# Altium project mb1225.PrjPCB (part 1 of 2)
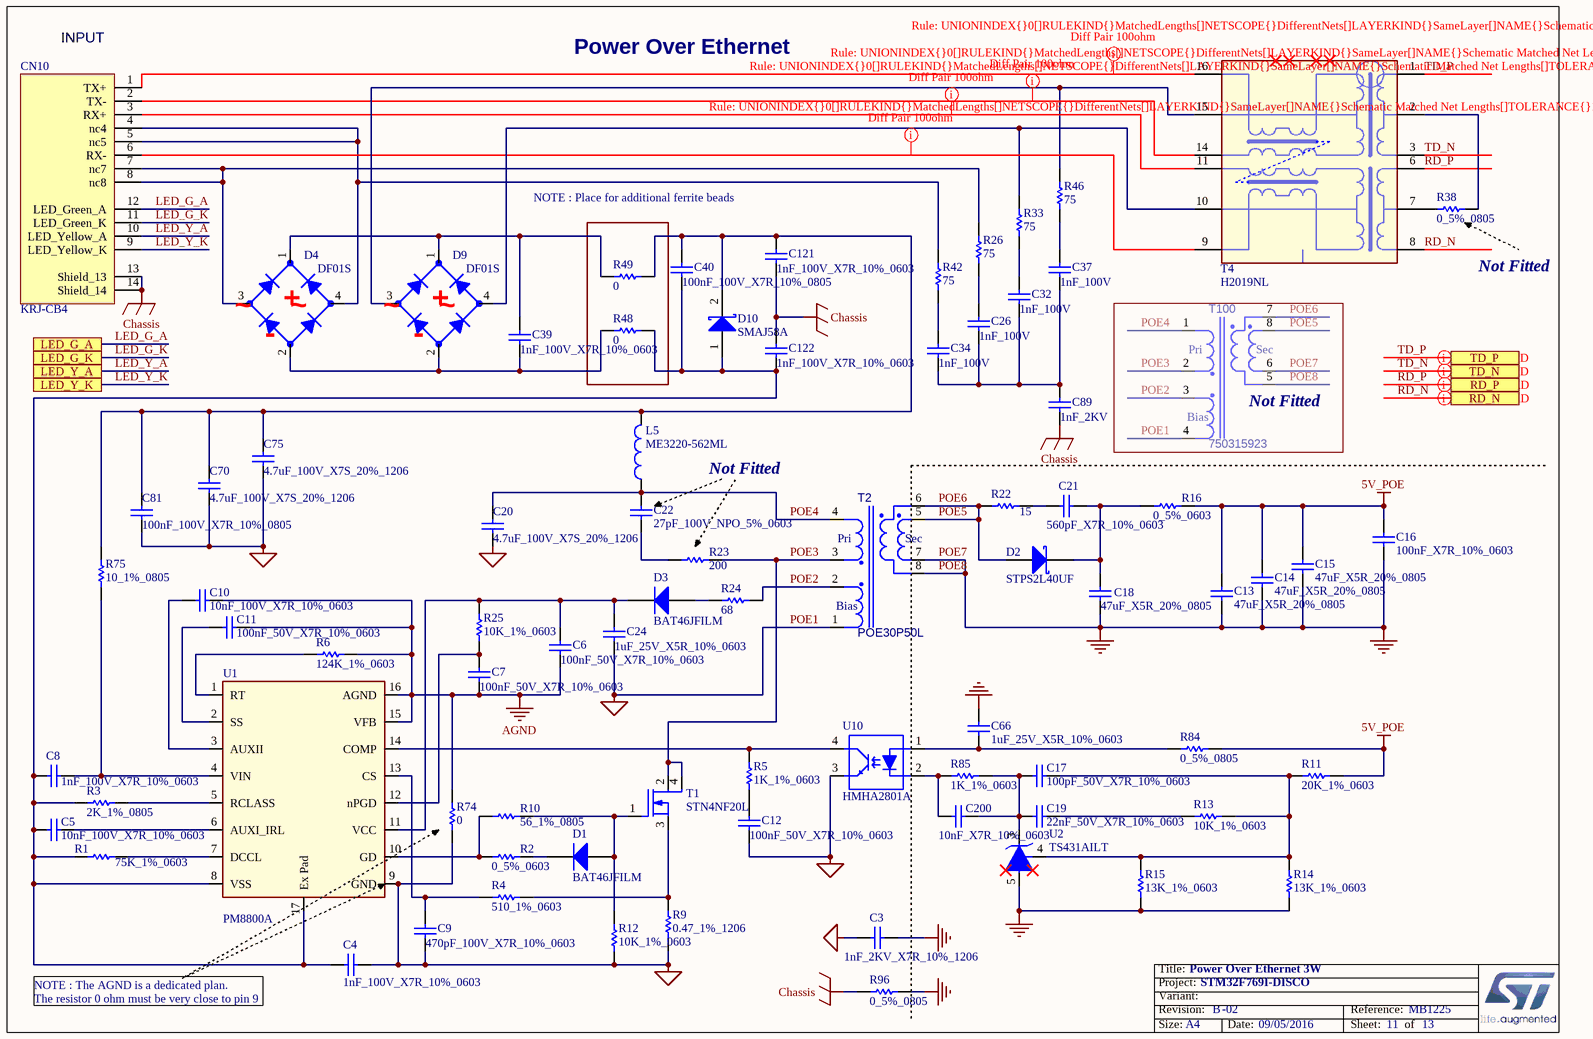
[diagram p0: PoE.SchDoc]
Board_Assembly_Revision: 02; Board_document_Date: 09/05/2016; Board_Name: STM32F769I-DISCO; Board_PCB_Revision: B; Board_Reference: MB1225
7 sheets, 271 parts. Net scope: hierarchical (ports join the sheet entries above them; power ports are global).
Board file: MB1225.PcbDoc
Sheets:
  PoE.SchDoc
  TOP.SchDoc
    U_AUDIO = AUDIO.SchDoc
    U_QSPI = QSPI.SchDoc
    U_SDRAM = SDRAM.SchDoc
    U_STM32F7 = STM32F7.SchDoc
    U_DSI_LCD = DSI_LCD.SchDoc

## Sheet PoE.SchDoc: Power Over Ethernet 3W
size A4; Date: 29-OCT-2015; Author: A.B; CompanyName: STMicroelectronics; Organization: MCD/TOOLS/GNB; Address1: 12, Rue Jules HOROWITZ; Address2: 38019 Grenoble; Address3: FRANCE; DocumentNumber: MB1225; Revision: B-01; SheetNumber: 11; SheetTotal: 13; Project: STM32F769I-DISCO

### Parts
C3  1nF_2KV_X7R_10%_1206  [1206C]
C4  1nF_100V_X7R_10%_0603  [0603C]
C5  10nF_100V_X7R_10%_0603  [0603C]
C6  100nF_50V_X7R_10%_0603  [0603C]
C7  100nF_50V_X7R_10%_0603  [0603C]
C8  1nF_100V_X7R_10%_0603  [0603C]
C9  470pF_100V_X7R_10%_0603  [0603C]
C10  10nF_100V_X7R_10%_0603  [0603C]
C11  100nF_50V_X7R_10%_0603  [0603C]
C12  100nF_50V_X7R_10%_0603  [0603C]
C13  47uF_X5R_20%_0805  [0805C]
C14  47uF_X5R_20%_0805  [0805C]
C15  47uF_X5R_20%_0805  [0805C]
C16  100nF_X7R_10%_0603  [0603C]
C17  100pF_50V_X7R_10%_0603  [0603C]
C18  47uF_X5R_20%_0805  [0805C]
C19  22nF_50V_X7R_10%_0603  [0603C]
C20  4.7uF_100V_X7S_20%_1206  [1206C]
C21  560pF_X7R_10%_0603  [0603C]
C22  27pF_100V_NPO_5%_0603  [0603C]
C24  1uF_25V_X5R_10%_0603  [0603C]
C26  1nF_100V  [0603C]
C32  1nF_100V  [0603C]
C34  1nF_100V  [0603C]
C37  1nF_100V  [0603C]
C39  1nF_100V_X7R_10%_0603  [0603C]
C40  100nF_100V_X7R_10%_0805  [0805C]
C66  1uF_25V_X5R_10%_0603  [0603C]
C70  4.7uF_100V_X7S_20%_1206  [1206C]
C75  4.7uF_100V_X7S_20%_1206  [1206C]
C81  100nF_100V_X7R_10%_0805  [0805C]
C89  1nF_2KV  [1206C]
C121  1nF_100V_X7R_10%_0603  [0603C]
C122  1nF_100V_X7R_10%_0603  [0603C]
C200  10nF_X7R_10%_0603  [0603C]
CN10  KRJ-CB4  [RJ45_LED_KRJ-CB4R2GYZNL_EM]
D1  BAT46JFILM  [SOD-323]
D2  STPS2L40UF  [SMB]
D3  BAT46JFILM  [SOD-323]
D4  DF01S  [DBS101-107G]
D9  DF01S  [DBS101-107G]
D10  SMAJ58A  [SMA]
L5  ME3220-562ML  [LSM2_3R2X2R8_H2]
R1  75K_1%_0603  [0603R]
R2  0_5%_0603  [0603R-GS]
R3  2K_1%_0805  [0805R]
R4  510_1%_0603  [0603R]
R5  1K_1%_0603  [0603R]
R6  124K_1%_0603  [0603R]
R9  0.47_1%_1206  [1206R]
R10  56_1%_0805  [0805R]
R11  20K_1%_0603  [0603R]
R12  10K_1%_0603  [0603R]
R13  10K_1%_0603  [0603R]
R14  13K_1%_0603  [0603R]
R15  13K_1%_0603  [0603R]
R16  0_5%_0603  [0603R-GS]
R22  15  [0805R]
R23  200  [1206R]
R24  68  [0805R]
R25  10K_1%_0603  [0603R]
R26  75  [0805R]
R33  75  [0805R]
R38  0_5%_0805  [0805R]
R42  75  [0805R]
R46  75  [0805R]
R48  0  [0805R]
R49  0  [0805R]
R74  0  [0603R-GS]
R75  10_1%_0805  [0805R]
R84  0_5%_0805  [0805R]
R85  1K_1%_0603  [0603R]
R96  0_5%_0805  [0805R]
T1  STN4NF20L  [SOT-223]
T2  POE30P50L  [TF_10R9X13R2-12R2X14R4_CPT]
T4  H2019NL  [TF_16SM_12R7X9R65]
T100  750315923  [TF_8SM_12R04X12R85]
U1  PM8800A  [TSSOP16_0R65_5x6R4_TP]
U2  TS431AILT  [SOT23-5]
U10  HMHA2801A  [PC_4SM_1R27_2R5X6R8]

### Blocks framed on the sheet
Not Fitted: T100

### Ports
LED_G_A, LED_G_K, LED_Y_A, LED_Y_K, RD_N, RD_P, TD_N, TD_P

### Nets
5V_POE: C13.2 C14.2 C15.2 C16.2 R11.2 R16.2 R84.2
AGND: C6.1 C7.1 C10.2 C11.2 R6.2 R74.2 U1.15(VFB) U1.16(AGND)
Chassis: C89.1 C121.1 C122.2 CN10.13(Shield_13) CN10.14(Shield_14) R96.1
POE1: C3.1 C4.2 C9.1 C12.1 C20.1 C24.1 C70.1 C75.1 C81.1 R9.1 R12.1 R74.1 T2.1 T100.4 U1.9(GND) U10.3(Emitter)  [also labelled GND_POWER_IN]
POE7: C3.2 C13.1 C14.1 C15.1 C16.1 C18.1 C66.2 R14.1 R15.1 R96.2 T2.7 T2.8 T100.5 T100.6 U2.5(A)  [also labelled GND, POE8]
LED_G_A: CN10.12(LED_Green_A) ; port LED_G_A
LED_G_K: CN10.11(LED_Green_K) ; port LED_G_K
LED_Y_A: CN10.10(LED_Yellow_A) ; port LED_Y_A
LED_Y_K: CN10.9(LED_Yellow_K) ; port LED_Y_K
POE2: R24.2 T2.2 T100.3
POE3: R23.2 T1.2(D) T1.4(D) T2.3 T100.2
POE4: C20.2 C22.2 L5.1 T2.4 T100.1
POE5: D2.1(A) R22.1 T2.5 T2.6 T100.7 T100.8  [also labelled POE6]
RD_N: T4.8(rd-) ; port RD_N
RD_P: T4.6(rd+) ; port RD_P
TD_N: T4.3(td-) ; port TD_N
TD_P: T4.1(td+) ; port TD_P
NetC4_1: C4.1 C5.1 C8.1 C40.1 C122.1 D10.1(A) R1.1 R3.1 R48.2 U1.8(VSS) U1.17(Ex_Pad)
NetC5_2: C5.2 U1.6(AUXI_IRL)
NetC6_2: C6.2 C24.2 D3.2(K) R25.2 U1.11(VCC)
NetC7_2: C7.2 R25.1 U1.12(nPGD)
NetC8_2: C8.2 R75.1 U1.4(VIN)
NetC9_2: C9.2 R4.1 U1.13(CS)
NetC10_1: C10.1 U1.3(AUXII)
NetC11_1: C11.1 U1.2(SS)
NetC12_2: C12.2 R5.1
NetC17_1: C17.1 C19.1 C200.2 R85.2 U2.3(K)
NetC17_2: C17.2 R11.1 R13.2 R14.2 R15.2 U2.4(REF)
NetC18_2: C18.2 C21.2 D2.2(K) R16.1
NetC19_2: C19.2 R13.1
NetC21_1: C21.1 R22.2
NetC22_1: C22.1 R23.1
NetC26_1: C26.1 C32.1 C34.1 C37.1 C89.2
NetC26_2: C26.2 R26.1
NetC32_2: C32.2 R33.1
NetC34_2: C34.2 R42.1
NetC37_2: C37.2 R46.1
NetC39_1: C39.1 D4.2(DC_OUT_MINUS) D9.2(DC_OUT_MINUS) R48.1
NetC39_2: C39.2 D4.1(DC_OUT_PLUS) D9.1(DC_OUT_PLUS) R49.1
NetC40_2: C40.2 C70.2 C75.2 C81.2 C121.2 D10.2(K) L5.2 R49.2 R75.2
NetC66_1: C66.1 R84.1 U10.1(Anode)
NetC200_1: C200.1 R85.1 U10.2(B)
NetCN10_1: CN10.1(TX+) T4.16(tx1+)
NetCN10_2: CN10.2(TX-) T4.14(tx1-)
NetCN10_3: CN10.3(RX+) T4.11(rx1+)
NetCN10_4: CN10.4(nc4) CN10.5(nc5) D4.4(AC_IN_1) R42.2
NetCN10_6: CN10.6(RX-) T4.9(rx-)
NetCN10_7: CN10.7(nc7) CN10.8(nc8) D4.3(AC_IN_2) R26.2
NetD1_1: D1.1(A) R10.2 R12.2 T1.1(G)
NetD1_2: D1.2(K) R2.2
NetD3_1: D3.1(A) R24.1
NetD9_3: D9.3(AC_IN_2) R46.2 T4.15(txct)
NetD9_4: D9.4(AC_IN_1) R33.2 T4.10(rxct)
NetR1_2: R1.2 U1.7(DCCL)
NetR2_1: R2.1 R10.1 U1.10(GD)
NetR3_2: R3.2 U1.5(RCLASS)
NetR4_2: R4.2 R9.2 T1.3(S)
NetR5_2: R5.2 U1.14(COMP) U10.4(Collector)
NetR6_1: R6.1 U1.1(RT)
NetR38_1: R38.1 T4.7(rct)
NetR38_2: R38.2 T4.2(tct)

Not connected (* = marked no-connect by the designer): T4 4(nc_4)* 5(nc_5)* 12(nc_12)* 13(nc_13)*; U2 1(nc_1)* 2(nc_2)*

### Layout directives
differential pair: RD_N, RD_P, TD_N, TD_P
rule Matched Net Lengths [Tolerance = 100mil]: NetCN10_1, NetCN10_2, NetCN10_3, NetCN10_6

### Notes on the sheet
- (near CN10) INPUT
- Power Over Ethernet
- NOTE : Place for additional ferrite beads
- (near R38) Not Fitted
- Not Fitted
- NOTE : The AGND is a dedicated plan.
  The resistor 0 ohm must be very close to pin 9
- Title:
- Project:
- Size:
- Revision:
- Variant:
- A4
- -
- Date:
- Reference:
- Sheet:
- of
- (in symbol DF01S_SMD) ~; +; -
- (in symbol POE30P_C) Pri; Sec; Bias
- (in symbol POE30P_W) Pri; Sec; Bias

### Library data of the parts
C3 C89 = Cap_1nF_2KV_X7R_10%_1206: Capacitor,1nF,2KV,X7R,10%,1206,YAGEO; Order: CC1206KKX7RDBB102; Revision: July-2002: Re-released for DXP Platform.; Value: 1nF; Manuf_1: YAGEO; Manuf_Part_1: CC1206KKX7RDBB102; ECCN_US/EU: n/a
C4 C8 C26 C32 C34 C37 C39 C121 C122 = Cap_1nF_100V_X7R_10%_0603: Capacitor,1nF,100V,X7R,10%,0603,YAGEO; Order: CC0603KRX7R0BB102; Revision: July-2002: Re-released for DXP Platform.; Value: 1nF; Manuf_1: YAGEO; Manuf_Part_1: CC0603KRX7R0BB102; ECCN_US/EU: n/a
C5 C10 = Cap_10nF_100V_X7R_10%_0603: Capacitor,10nF,100V,X7R,10%,0603,YAGEO; Manuf_Part_1: CC0603KRX7R0BB103; Revision: July-2002: Re-released for DXP Platform.; Value: 10nF; Order: CC0603KRX7R0BB103; Manuf_1: YAGEO; ECCN_US/EU: n/a
C6 C7 C11 C12 = Cap_100nF_50V_X7R_10%_0603: Capacitor,100nF,50V,X7R,10%,0603,YAGEO; Manuf_Part_1: CC0603KRX7R9BB104; Revision: July-2002: Re-released for DXP Platform.; Value: 100nF; Order: CC0603KRX7R9BB104; Manuf_1: YAGEO; ECCN_US/EU: n/a
C9 = Cap_470pF_100V_X7R_10%_0603: Capacitor,470pF,100V,X7R,10%,0603,AVX; Manuf_Part_1: 06031C471KAT2A; Revision: July-2002: Re-released for DXP Platform.; Value: 470pF; Order: 06031C471KAT2A; Manuf_1: AVX; ECCN_US/EU: n/a
C13-C15 C18 = Cap_47uF_X5R_20%_0805: Capacitor,47uF,10V,X5R,20%,0805,MURATA; Manuf_Part_1: GRM21BR61A476ME15K; Order: GRM21BR61A476ME15K-ND; Revision: July-2002: Re-released for DXP Platform.; Value: 47uF; Manuf_1: MURATA; ECCN_US/EU: n/a
C16 = Cap_100nF_X7R_10%_0603: Capacitor,100nF,16V,X7R,10%,0603,YAGEO; Manuf_Part_1: CC0603KRX7R9BB104; Revision: July-2002: Re-released for DXP Platform.; Value: 100nF; Order: CC0603KRX7R9BB104; Manuf_1: YAGEO; ECCN_US/EU: n/a
C17 = Cap_100pF_50V_X7R_10%_0603: Capacitor,100pF,50V,X7R,10%,0603,AVX; Manuf_Part_1: 06035C101JAT4A; Revision: July-2002: Re-released for DXP Platform.; Value: 100pF; Order: 06035C101JAT4A; Manuf_1: AVX; ECCN_US/EU: n/a
C19 = Cap_22nF_50V_X7R_10%_0603: Capacitor,22nF,50V,X7R,10%,0603,YAGEO; Manuf_Part_1: CC0603KRX7R9BB223; Revision: July-2002: Re-released for DXP Platform.; Value: 22nF; Order: CC0603KRX7R9BB223; Manuf_1: YAGEO; ECCN_US/EU: n/a
C20 C70 C75 = Cap_4.7uF_100V_X7S_20%_1206: Capacitor,4.7uF,100V, X7S,20%,1206,AVX; Manuf_Part_1: 12061Z475MAT2A; Revision: July-2002: Re-released for DXP Platform.; Value: 4.7uF; Order: *; Manuf_1: AVX; ECCN_US/EU: n/a; Distrib: Sub Co
C21 = Cap_560pF_X7R_10%_0603: Capacitor,560pF,16V,X7R,10%,0603,AVX; Manuf_Part_1: 0603YC561KAT2A; Revision: July-2002: Re-released for DXP Platform.; Value: 560pF; Order: 0603YC561KAT2A; Manuf_1: AVX; ECCN_US/EU: n/a
C22 = Cap_27pF_100V_NPO_5%_0603: Capacitor,27pF,100V,NPO,5%,0603,YAGEO; Manuf_Part_1: CC0603JRNPO0BN270; Manuf_2: AVX; Manuf_Part_2: 06031A270JAT2A; Fitted: NO; Revision: July-2002: Re-released for DXP Platform.; Value: 27pF; Manuf_1: YAGEO; ECCN_US/EU: n/a
C24 C66 = Cap_1uF_25V_X5R_10%_0603: Capacitor,1uF,25V,X5R,10%,0603,YAGEO; Manuf_Part_1: CC0603KRX5R8BB105; Revision: July-2002: Re-released for DXP Platform.; Value: 1uF; Order: CC0603KRX5R8BB105; Manuf_1: YAGEO; ECCN_US/EU: n/a
C40 C81 = Cap_100nF_100V_X7R_10%_0805: Capacitor,100nF,100V,X7R,10%,0805,TDK; Order: C2012X7R2A104K125AA; Revision: July-2002: Re-released for DXP Platform.; Value: 100nF; Manuf_1: TDK; Manuf_Part_1: C2012X7R2A104K125AA; ECCN_US/EU: n/a
C200 = Cap_10nF_X7R_10%_0603: Capacitor,10nF,50V,X7R,10%,0603,YAGEO; Manuf_Part_1: CC0603KRX7R9BB103; Revision: July-2002: Re-released for DXP Platform.; Value: 10nF; Order: CC0603KRX7R9BB103; Manuf_1: YAGEO; ECCN_US/EU: n/a
CN10 = KRJ-CB4: 100 Base-TX (Fast Ethernet)  RJ45 single port (1x1) with LEDS Integrated Connector; Manuf_1: DGKYD; Manuf_Part_1: KRJ-CB4.2GYZNL; Distrib: Sub Co; Ref St: *; ECCN_US/EU: n/a
D1 D3 = BAT46JFILM: Schottky Single diode(150mA, 100V); Manuf_1: STM; Provided: ST; ECCN_US/EU: EAR99/NEC; Ref St: 9151125; Revision: July-2002: Re-released for DXP Platform.; Order: BAT46JFILM; Manuf_Part_1: BAT46JFILM; Distrib: ST
D2 = STPS2L40UF: Low drop power Schottky rectifier(2A, 40V, 0.34V); Manuf_1: STM; Order: STPS2L40AF; Provided: ST; ECCN_US/EU: EAR99/NEC; Code - JEDEC: ******; Note: SMB footprint will accept STPS2L40U/UF/AF; Ref St: 9151009; Manuf_Part_1: STPS2L40UF; Distrib: ST; Manuf_Part_2: STPS2L40U; Manuf_Part_3: STPS2L40AF
D4 D9 = DF01S_SMD: Surface Mount Bridge Rectifiers; Manuf_1: VISHAY; Manuf_2: DIODES; Manuf_3: FAIRCHILD; Disrib: Sub Co; ECCN_US/EU: n/a; Manuf_Part_1: DF01S; Manuf_Part_2: DF01S; Manuf_Part_3: DF01S
D10 = SMAJ58A: Transil 400W, VRM=58V; Manuf_1: STM; Manuf_Part_1: SMAJ58A-TR; ECCN_US/EU: EAR99/NEC; Provided: ST; Ref St: 9151124; Order: SMAJ58A-TR; Distrib: ST
L5 = ME3220-562ML: Power Inductor, 5.6uH, 0.2R, ME3220-562ML, CoilCraft; Manuf_2: Cyntec; Manuf_Part_2: SDET32251E-5R6MS-11; Revision: July-2002: Re-released for DXP Platform.; Value: 5.6uH; Manuf_Part_1: ME3220-562ML; Manuf_1: CoilCraft; Description_2: Power Inductor, 5.6uH, 0.2R, ME3220-562ML, CoilCraft; ECCN_US/EU: n/a
R1 = Res_75K_1%_0603: Resistor,75K,0603,1%,YAGEO; Manuf_Part_1: RC0603FR-0775KL; Value: 75K; ECCN_US/EU: n/a; Manuf_1: YAGEO; Distrib: Sub Co; Order: RC0603FR-0775KL
R2 R16 = Res_0_5%_0603: Resistor,0,0603,5%,YAGEO; Manuf_Part_1: RC0603JR-070RL; Value: 0; Order: 2363481; ECCN_US/EU: n/a; Manuf_1: YAGEO; Distrib: FARNELL
R3 = Res_2K_1%_0805: Resistor,2K,0805,1%,YAGEO; Manuf_Part_1: RC0805FR-072KL; Manuf_Part_2: RT0805FRE072KL; Value: 2K; Manuf_1: YAGEO; ECCN_US/EU: n/a
R4 = Res_510_1%_0603: Resistor,510,0603,1%,YAGEO; Manuf_Part_1: RC0603FR-07510RL; Value: 510; Manuf_1: YAGEO; Order: RC0603FR-07510RL; ECCN_US/EU: n/a; Distrib: Sub Co
R5 R85 = Res_1K_1%_0603: Resistor,1K,0603,1%,YAGEO; Manuf_Part_1: RC0603FR-071KL; Value: 1K; Manuf_1: YAGEO; Order: RC0603FR-071KL; ECCN_US/EU: n/a
R6 = Res_124K_1%_0603: Resistor,124K,0603,1%,YAGEO; Manuf_Part_1: RC0603FR-07124KL; Value: 124K; ECCN_US/EU: n/a; Manuf_1: YAGEO; Distrib: Sub Co; Order: RC0603FR-07124KL
R9 = Res_0.47_1%_1206: Resistor,0.47,1206,1%,YAGEO; Manuf_Part_1: RL1206FR-070R47L; Manuf_Part_2: LTR18EZPFLR470; Manuf_2: Rohm Semiconductor; Value: 0.47; Manuf_1: YAGEO; ECCN_US/EU: n/a
R10 = Res_56_1%_0805: Resistor,56,0805,1%,YAGEO; Manuf_Part_1: RC0805FR-0756RL; Value: 56; Order: 311-56.0CRTR-ND; Manuf_1: YAGEO; ECCN_US/EU: n/a; Distrib: DIGIKEY
R11 = Res_20K_1%_0603: Resistor,20K,0603,1%,YAGEO; Manuf_Part_1: RC0603FR-0720KL; Value: 20K; Manuf_1: YAGEO; Order: RC0603FR-0720KL; ECCN_US/EU: n/a
R12 R13 R25 = Res_10K_1%_0603: Resistor,10K,0603,1%,YAGEO; Manuf_Part_1: RC0603FR-0710KL; Value: 10K; Manuf_1: YAGEO; Order: RC0603FR-0710KL; ECCN_US/EU: n/a
R14 R15 = Res_13K_1%_0603: Resistor,13K,0603,1%,YAGEO; Manuf_Part_1: RC0603FR-0713KL; Value: 13K; Manuf_1: YAGEO; Order: RC0603FR-0713KL; ECCN_US/EU: n/a; Distrib: Sub Co
R22 = Res_15_1%_0805: Resistor,15,0805,1%,YAGEO; Manuf_Part_1: RC0805FR-0715RL; Value: 15; Manuf_1: YAGEO; Order: RC0805FR-0715RL; ECCN_US/EU: n/a
R23 = Res_200_1%_1206: Resistor,200,1206,1%,Rohm; Manuf_Part_1: LTR18EZPF2000; Manuf_1: Rohm Semiconductor; Fitted: NO; Value: 200; Order: LTR18EZPF2000; ECCN_US/EU: n/a
R24 = Res_68_1%_0805: Resistor,68,0805,1%,YAGEO; Manuf_Part_1: RC0805FR-0768RL; Value: 68; Manuf_1: YAGEO; Order: RC0805FR-0768RL; ECCN_US/EU: n/a
R26 R33 R42 R46 = Res_75_1%_0805: Resistor,75,0805,1%,YAGEO; Manuf_Part_1: RC0805FR-0775RL; Order: 311-75.0CRTR-ND; Value: 75; Manuf_1: YAGEO; ECCN_US/EU: n/a; Distrib: DIGIKEY
R38 = Res_0_5%_0805: Resistor,0,0805,5%,YAGEO; Manuf_Part_1: RC0805JR-070RL; Value: 0; Order: 2363489; Fitted: NO; ECCN_US/EU: n/a; Manuf_1: YAGEO
R48 R49 = Res_0_5%_0805: Resistor,0,0805,5%,YAGEO; Manuf_Part_1: RC0805JR-070RL; Order: 2363489; Value: 0; ECCN_US/EU: n/a; Manuf_1: YAGEO
R74 = Res_0_5%_0603: Resistor,0,0603,5%,YAGEO; Manuf_Part_1: RC0603JR-070RL; Order: 2363481; Value: 0; ECCN_US/EU: n/a; Manuf_1: YAGEO; Distrib: FARNELL
R75 = Res_10_1%_0805: Resistor,10,0805,1%,Stackpole,1/4W; Manuf_Part_1: RNCP0805FTD10R0; Manuf_1: Stackpole Electronics Inc; Value: 10; Order: RNCP0805FTD10R0; ECCN_US/EU: n/a
R84 R96 = Res_0_5%_0805: Resistor,0,0805,5%,YAGEO; Manuf_Part_1: RC0805JR-070RL; Value: 0; Order: 2363489; ECCN_US/EU: n/a; Manuf_1: YAGEO
T1 = STN4NF20L: N-channel 200 V, 1.1ohm, 1 A, low gate charge STripFET II, Power MOSFET; Manuf_2: Fairchild; Manuf_Part_2: FDN86246; Manuf_1: ST; ECCN_US/EU: EAR99/NEC; Ref St: 9153018; Manuf_Part_1: STN4NF20L; Provided: ST
T2 = POE30P_C: Flyback Transformers for 3 Watt, PoE applications, CoilCraft Cyntec; Manuf_Part_1: POEP30P50L; Manuf_Part_2: 86H-15181; Provided: Sub Co; Note: for Cyntec, Secondary 6, 7 removed; Manuf_1: CoilCraft; ECCN_US/EU: n/a; Manuf_2: Cyntec
T4 = H2019: 10/100BASE-TX VoIP Magnetics Modules, Data Transformer; Manuf_Part_2: TLA-6T127LF, with different pinout; Manuf_1: PULSE; Manuf_2: TDK; Manuf_Part_3: KMS-1102NL; Manuf_3: DGKYD; Double foot print: TLA-6T127LF, pin 10, 12, 13, 15 differents; ECCN_US/EU: EAR99/NEC; Manuf_Part_1: H2019NL
T100 = POE30P_W: Flyback Transformers for 3 Watt, PoE applications, Wurth; Provided: Sub Co; Note: Compatible with CoilCraft but swap pins 1 and 4, pins 2 and 3, pins 5 and 8, pins 6 and 7; Fitted: NO; Manuf_1: Wurth; Manuf_Part_1: 750315923; ECCN_US/EU: n/a
U1 = PM8800A: Integrated IEEE 802.3af compliant PoE-PD interface, and PWM controller with support of external source; Manuf_Part_1: PM8800ATR; Manuf_1: ST; Provided: STM; ECCN_US/EU: EAR99/NEC; Ref St: 9177966; Distrib: ST
U2 = TS431AILT: Low voltage adjustable shunt reference; Manuf_1: ST; ECCN_US/EU: EAER99/NEC; Ref St: 9177032; Manuf_Part_1: TS431AILT; Provided: ST
U10 = HMHA2801A: OPTOISOLATOR 3.7KV TRANSISTOR 4SMD; Manuf_1: FAIRCHILD; Order: HMHA2801A-ND; ECCN_US/EU: EAR99/NEC; Manuf_Part_1: HMHA2801A; Distrib: DIGIKEY

## Sheet TOP.SchDoc: STM32F769 Discovery Interconnexion
size A4; Date: 29-OCT-2015; Author: A.B; CompanyName: STMicroelectronics; Organization: MCD/TOOLS/GNB; Address1: 12, Rue Jules HOROWITZ; Address2: 38019 Grenoble; Address3: FRANCE; DocumentNumber: MB1225; Revision: B-01; SheetNumber: 2; SheetTotal: 13; Project: STM32F769I-DISCO
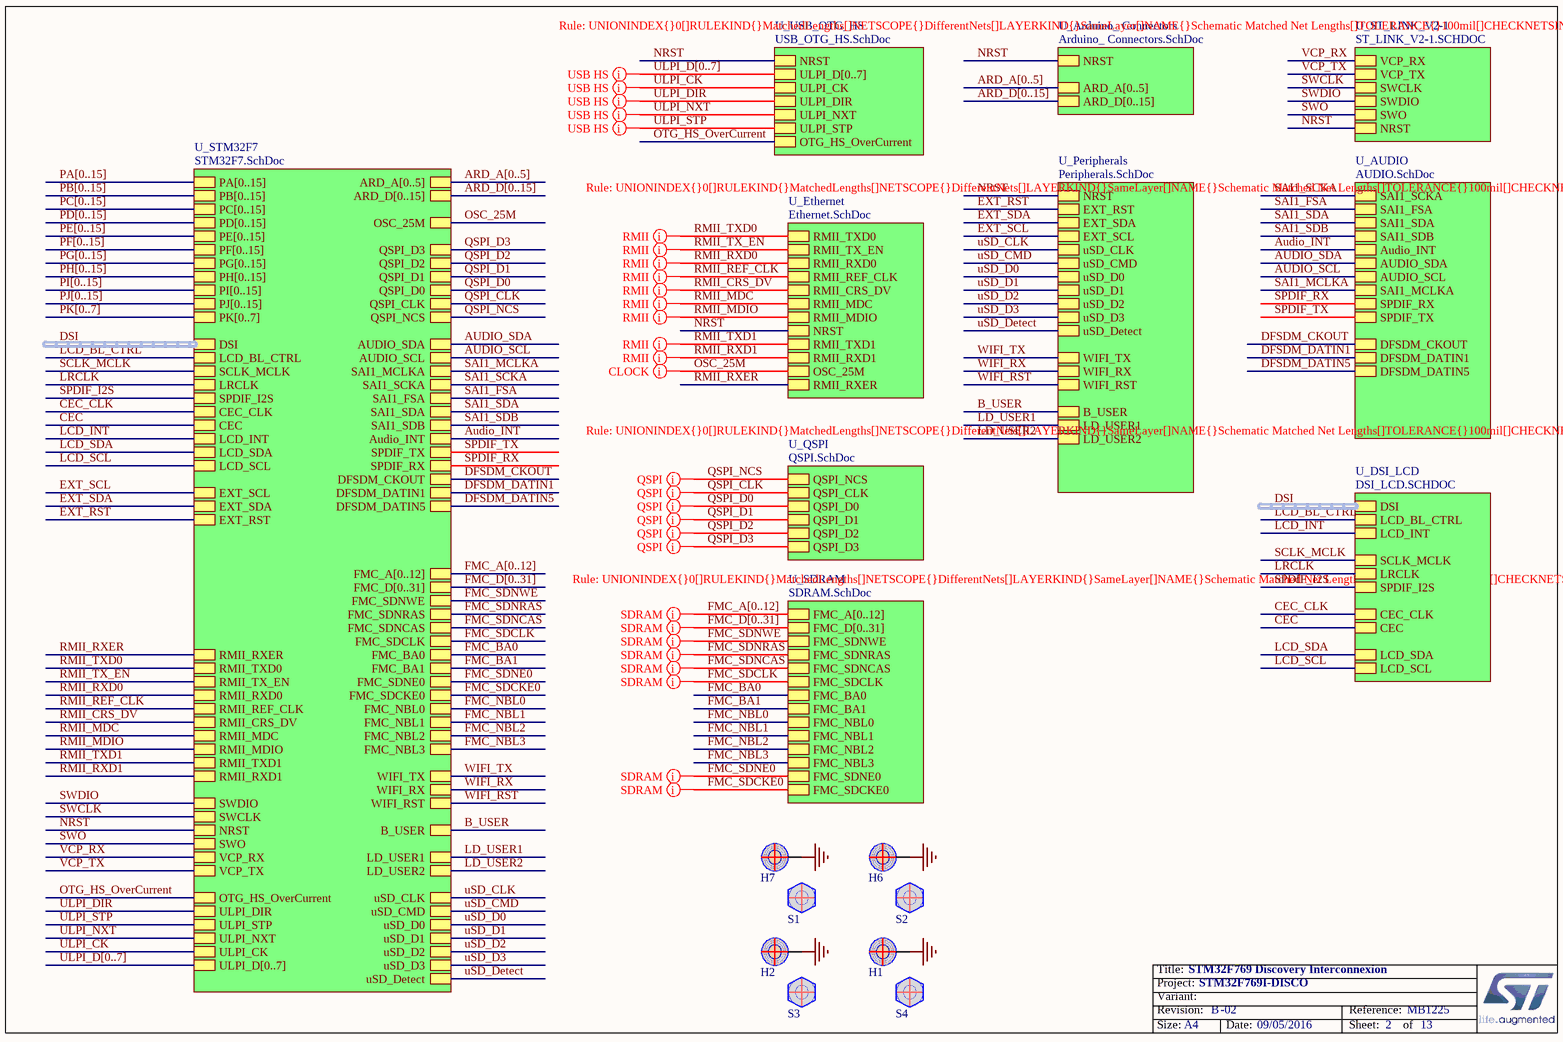
[diagram p1: TOP.SchDoc]

### Parts
H1  POSITION HOLE C6D3R5  [HOLE_C6D3R5]  (value not drawn)
H2  POSITION HOLE C6D3R5  [HOLE_C6D3R5]  (value not drawn)
H6  POSITION HOLE C6D3R5  [HOLE_C6D3R5]  (value not drawn)
H7  POSITION HOLE C6D3R5  [HOLE_C6D3R5]  (value not drawn)
S1  Nylon Screw/Spacer M3x12.7  (value not drawn)
S2  Nylon Screw/Spacer M3x12.7  (value not drawn)
S3  Nylon Screw/Spacer M3x12.7  (value not drawn)
S4  Nylon Screw/Spacer M3x12.7  (value not drawn)

### Sub-sheets
U_Arduino_ Connectors = Arduino_ Connectors.SchDoc (file not in this document): NRST, ARD_D[0..15], ARD_A[0..5]
U_AUDIO = AUDIO.SchDoc: AUDIO_SDA, AUDIO_SCL, SAI1_MCLKA, SPDIF_RX, SAI1_SCKA, SAI1_FSA, SAI1_SDA, SAI1_SDB, Audio_INT, SPDIF_TX, DFSDM_CKOUT, DFSDM_DATIN1, DFSDM_DATIN5
U_DSI_LCD = DSI_LCD.SCHDOC: DSI (harness DSI), LCD_INT, LCD_BL_CTRL, SCLK_MCLK, LRCLK, SPDIF_I2S, CEC_CLK, CEC, LCD_SDA, LCD_SCL
U_Ethernet = Ethernet.SchDoc (file not in this document): RMII_TXD0, RMII_TX_EN, RMII_RXD0, RMII_REF_CLK, RMII_CRS_DV, RMII_MDC, RMII_MDIO, NRST, RMII_TXD1, RMII_RXD1, OSC_25M, RMII_RXER
U_Peripherals = Peripherals.SchDoc (file not in this document): NRST, EXT_RST, EXT_SCL, EXT_SDA, uSD_CLK, uSD_CMD, uSD_D0, uSD_D1, uSD_D2, uSD_D3, uSD_Detect, B_USER, WIFI_TX, WIFI_RX, WIFI_RST, LD_USER1, LD_USER2
U_QSPI = QSPI.SchDoc: QSPI_D0, QSPI_D3, QSPI_D1, QSPI_CLK, QSPI_NCS, QSPI_D2
U_SDRAM = SDRAM.SchDoc: FMC_A[0..12], FMC_SDNWE, FMC_SDNRAS, FMC_SDNCAS, FMC_SDCLK, FMC_BA0, FMC_BA1, FMC_NBL0, FMC_NBL1, FMC_SDNE0, FMC_SDCKE0, FMC_D[0..31], FMC_NBL2, FMC_NBL3
U_ST_LINK_V2-1 = ST_LINK_V2-1.SCHDOC (file not in this document): SWDIO, SWCLK, NRST, VCP_RX, VCP_TX, SWO
U_STM32F7 = STM32F7.SchDoc: PA[0..15], PB[0..15], PC[0..15], PD[0..15], PE[0..15], PF[0..15], PG[0..15], PH[0..15], PI[0..15], PJ[0..15], PK[0..7], OSC_25M, RMII_TXD0, RMII_TX_EN, RMII_RXD0, RMII_REF_CLK, RMII_CRS_DV, RMII_MDC, RMII_MDIO, RMII_TXD1, RMII_RXD1, ULPI_D[0..7], ULPI_CK, ULPI_DIR, ULPI_NXT, ULPI_STP, QSPI_D0, QSPI_D3, QSPI_D1, QSPI_CLK, QSPI_NCS, AUDIO_SDA, AUDIO_SCL, SAI1_MCLKA, EXT_SCL, EXT_SDA, EXT_RST, uSD_CLK, uSD_CMD, uSD_D0, uSD_D1, uSD_D2, uSD_D3, uSD_Detect, SWDIO, SWCLK, NRST, SWO, VCP_RX, VCP_TX, FMC_A[0..12], FMC_D[0..31], FMC_SDNWE, FMC_SDNRAS, FMC_SDNCAS, FMC_SDCLK, FMC_BA0, FMC_BA1, FMC_SDNE0, FMC_SDCKE0, FMC_NBL0, FMC_NBL1, SPDIF_RX, QSPI_D2, B_USER, ARD_D[0..15], RMII_RXER, OTG_HS_OverCurrent, SAI1_SCKA, SAI1_FSA, SAI1_SDA, SAI1_SDB, Audio_INT, SPDIF_TX, FMC_NBL2, FMC_NBL3, DSI (harness DSI), LCD_BL_CTRL, SCLK_MCLK, LRCLK, SPDIF_I2S, CEC_CLK, CEC, LCD_INT, LCD_SDA, LCD_SCL, WIFI_RST, WIFI_RX, WIFI_TX, ARD_A[0..5], LD_USER1, LD_USER2, DFSDM_CKOUT, DFSDM_DATIN1, DFSDM_DATIN5
U_USB_OTG_HS = USB_OTG_HS.SchDoc (file not in this document): ULPI_D[0..7], ULPI_CK, ULPI_DIR, ULPI_NXT, ULPI_STP, NRST, OTG_HS_OverCurrent

### Nets
GND: H1.1 H2.1 H6.1 H7.1  [project net POE7]
Audio_INT: sheet U_AUDIO/Audio_INT, sheet U_STM32F7/Audio_INT
AUDIO_SCL: sheet U_AUDIO/AUDIO_SCL, sheet U_STM32F7/AUDIO_SCL, sheet U_STM32F7/LCD_SCL, sheet U_DSI_LCD/LCD_SCL  [also labelled LCD_SCL]
AUDIO_SDA: sheet U_AUDIO/AUDIO_SDA, sheet U_STM32F7/AUDIO_SDA, sheet U_STM32F7/LCD_SDA, sheet U_DSI_LCD/LCD_SDA  [also labelled LCD_SDA]
B_USER: sheet U_Peripherals/B_USER, sheet U_STM32F7/B_USER
CEC: sheet U_STM32F7/CEC, sheet U_DSI_LCD/CEC
CEC_CLK: sheet U_STM32F7/CEC_CLK, sheet U_DSI_LCD/CEC_CLK
DFSDM_CKOUT: sheet U_AUDIO/DFSDM_CKOUT, sheet U_STM32F7/DFSDM_CKOUT
DFSDM_DATIN1: sheet U_AUDIO/DFSDM_DATIN1, sheet U_STM32F7/DFSDM_DATIN1
DFSDM_DATIN5: sheet U_AUDIO/DFSDM_DATIN5, sheet U_STM32F7/DFSDM_DATIN5
EXT_RST: sheet U_Peripherals/EXT_RST, sheet U_STM32F7/EXT_RST
EXT_SCL: sheet U_Peripherals/EXT_SCL, sheet U_STM32F7/EXT_SCL
EXT_SDA: sheet U_Peripherals/EXT_SDA, sheet U_STM32F7/EXT_SDA
FMC_BA0: sheet U_SDRAM/FMC_BA0, sheet U_STM32F7/FMC_BA0
FMC_BA1: sheet U_SDRAM/FMC_BA1, sheet U_STM32F7/FMC_BA1
FMC_NBL0: sheet U_SDRAM/FMC_NBL0, sheet U_STM32F7/FMC_NBL0
FMC_NBL1: sheet U_SDRAM/FMC_NBL1, sheet U_STM32F7/FMC_NBL1
FMC_NBL2: sheet U_SDRAM/FMC_NBL2, sheet U_STM32F7/FMC_NBL2
FMC_NBL3: sheet U_SDRAM/FMC_NBL3, sheet U_STM32F7/FMC_NBL3
FMC_SDCKE0: sheet U_SDRAM/FMC_SDCKE0, sheet U_STM32F7/FMC_SDCKE0
FMC_SDCLK: sheet U_SDRAM/FMC_SDCLK, sheet U_STM32F7/FMC_SDCLK
FMC_SDNCAS: sheet U_SDRAM/FMC_SDNCAS, sheet U_STM32F7/FMC_SDNCAS
FMC_SDNE0: sheet U_SDRAM/FMC_SDNE0, sheet U_STM32F7/FMC_SDNE0
FMC_SDNRAS: sheet U_SDRAM/FMC_SDNRAS, sheet U_STM32F7/FMC_SDNRAS
FMC_SDNWE: sheet U_SDRAM/FMC_SDNWE, sheet U_STM32F7/FMC_SDNWE
LCD_BL_CTRL: sheet U_STM32F7/LCD_BL_CTRL, sheet U_DSI_LCD/LCD_BL_CTRL
LCD_INT: sheet U_STM32F7/LCD_INT, sheet U_DSI_LCD/LCD_INT
LD_USER1: sheet U_Peripherals/LD_USER1, sheet U_STM32F7/LD_USER1
LD_USER2: sheet U_Peripherals/LD_USER2, sheet U_STM32F7/LD_USER2
LRCLK: sheet U_STM32F7/LRCLK, sheet U_DSI_LCD/LRCLK
NRST: sheet U_ST_LINK_V2-1/NRST, sheet U_Peripherals/NRST, sheet U_Arduino_ Connectors/NRST, sheet U_USB_OTG_HS/NRST, sheet U_STM32F7/NRST, sheet U_Ethernet/NRST
OSC_25M: sheet U_STM32F7/OSC_25M, sheet U_Ethernet/OSC_25M
OTG_HS_OverCurrent: sheet U_USB_OTG_HS/OTG_HS_OverCurrent, sheet U_STM32F7/OTG_HS_OverCurrent
QSPI_CLK: sheet U_QSPI/QSPI_CLK, sheet U_STM32F7/QSPI_CLK  [project net PB2]
QSPI_D0: sheet U_QSPI/QSPI_D0, sheet U_STM32F7/QSPI_D0  [project net PC9]
QSPI_D1: sheet U_QSPI/QSPI_D1, sheet U_STM32F7/QSPI_D1  [project net PC10]
QSPI_D2: sheet U_QSPI/QSPI_D2, sheet U_STM32F7/QSPI_D2  [project net PE2]
QSPI_D3: sheet U_QSPI/QSPI_D3, sheet U_STM32F7/QSPI_D3  [project net PD13]
QSPI_NCS: sheet U_QSPI/QSPI_NCS, sheet U_STM32F7/QSPI_NCS  [project net PB6]
RMII_CRS_DV: sheet U_STM32F7/RMII_CRS_DV, sheet U_Ethernet/RMII_CRS_DV  [project net PA7]
RMII_MDC: sheet U_STM32F7/RMII_MDC, sheet U_Ethernet/RMII_MDC  [project net PC1]
RMII_MDIO: sheet U_STM32F7/RMII_MDIO, sheet U_Ethernet/RMII_MDIO  [project net PA2]
RMII_REF_CLK: sheet U_STM32F7/RMII_REF_CLK, sheet U_Ethernet/RMII_REF_CLK  [project net PA1]
RMII_RXD0: sheet U_STM32F7/RMII_RXD0, sheet U_Ethernet/RMII_RXD0  [project net PC4]
RMII_RXD1: sheet U_STM32F7/RMII_RXD1, sheet U_Ethernet/RMII_RXD1  [project net PC5]
RMII_RXER: sheet U_STM32F7/RMII_RXER, sheet U_Ethernet/RMII_RXER  [project net PD5]
RMII_TX_EN: sheet U_STM32F7/RMII_TX_EN, sheet U_Ethernet/RMII_TX_EN  [project net PG11]
RMII_TXD0: sheet U_STM32F7/RMII_TXD0, sheet U_Ethernet/RMII_TXD0  [project net PG13]
RMII_TXD1: sheet U_STM32F7/RMII_TXD1, sheet U_Ethernet/RMII_TXD1  [project net PG14]
SAI1_FSA: sheet U_AUDIO/SAI1_FSA, sheet U_STM32F7/SAI1_FSA  [project net PE4]
SAI1_MCLKA: sheet U_AUDIO/SAI1_MCLKA, sheet U_STM32F7/SAI1_MCLKA  [project net PG7]
SAI1_SCKA: sheet U_AUDIO/SAI1_SCKA, sheet U_STM32F7/SAI1_SCKA  [project net PE5]
SAI1_SDA: sheet U_AUDIO/SAI1_SDA, sheet U_STM32F7/SAI1_SDA  [project net PE6]
SAI1_SDB: sheet U_AUDIO/SAI1_SDB, sheet U_STM32F7/SAI1_SDB  [project net PE3]
SCLK_MCLK: sheet U_STM32F7/SCLK_MCLK, sheet U_DSI_LCD/SCLK_MCLK
SPDIF_I2S: sheet U_AUDIO/SPDIF_TX, sheet U_STM32F7/SPDIF_TX, sheet U_STM32F7/SPDIF_I2S, sheet U_DSI_LCD/SPDIF_I2S  [also labelled SPDIF_TX]  [project net PD11]
SPDIF_RX: sheet U_AUDIO/SPDIF_RX, sheet U_STM32F7/SPDIF_RX  [project net PG12]
SWCLK: sheet U_ST_LINK_V2-1/SWCLK, sheet U_STM32F7/SWCLK  [project net PA14]
SWDIO: sheet U_ST_LINK_V2-1/SWDIO, sheet U_STM32F7/SWDIO  [project net PA13]
SWO: sheet U_ST_LINK_V2-1/SWO, sheet U_STM32F7/SWO
ULPI_CK: sheet U_USB_OTG_HS/ULPI_CK, sheet U_STM32F7/ULPI_CK  [project net PA5]
ULPI_DIR: sheet U_USB_OTG_HS/ULPI_DIR, sheet U_STM32F7/ULPI_DIR  [project net PI11]
ULPI_NXT: sheet U_USB_OTG_HS/ULPI_NXT, sheet U_STM32F7/ULPI_NXT  [project net PH4]
ULPI_STP: sheet U_USB_OTG_HS/ULPI_STP, sheet U_STM32F7/ULPI_STP  [project net PC0]
uSD_CLK: sheet U_Peripherals/uSD_CLK, sheet U_STM32F7/uSD_CLK  [project net PD6]
uSD_CMD: sheet U_Peripherals/uSD_CMD, sheet U_STM32F7/uSD_CMD  [project net PD7]
uSD_D0: sheet U_Peripherals/uSD_D0, sheet U_STM32F7/uSD_D0  [project net PG9]
uSD_D1: sheet U_Peripherals/uSD_D1, sheet U_STM32F7/uSD_D1  [project net PG10]
uSD_D2: sheet U_Peripherals/uSD_D2, sheet U_STM32F7/uSD_D2
uSD_D3: sheet U_Peripherals/uSD_D3, sheet U_STM32F7/uSD_D3  [project net PB4]
uSD_Detect: sheet U_Peripherals/uSD_Detect, sheet U_STM32F7/uSD_Detect  [project net PI15]
VCP_RX: sheet U_ST_LINK_V2-1/VCP_RX, sheet U_STM32F7/VCP_RX  [project net PA10]
VCP_TX: sheet U_ST_LINK_V2-1/VCP_TX, sheet U_STM32F7/VCP_TX  [project net PA9]
WIFI_RST: sheet U_Peripherals/WIFI_RST, sheet U_STM32F7/WIFI_RST  [project net PJ14]
WIFI_RX: sheet U_Peripherals/WIFI_RX, sheet U_STM32F7/WIFI_RX  [project net PC12]
WIFI_TX: sheet U_Peripherals/WIFI_TX, sheet U_STM32F7/WIFI_TX  [project net PD2]

### Buses and harness runs
bus ARD_A[0..5] = sheet U_Arduino_ Connectors/ARD_A[0..5]
bus ARD_A[0..5] = sheet U_STM32F7/ARD_A[0..5]
bus ARD_D[0..15] = sheet U_Arduino_ Connectors/ARD_D[0..15]
bus ARD_D[0..15] = sheet U_STM32F7/ARD_D[0..15]
bus FMC_A[0..12] = sheet U_SDRAM/FMC_A[0..12]
bus FMC_A[0..12] = sheet U_STM32F7/FMC_A[0..12]
bus FMC_D[0..31] = sheet U_SDRAM/FMC_D[0..31]
bus FMC_D[0..31] = sheet U_STM32F7/FMC_D[0..31]
bus PA[0..15] = sheet U_STM32F7/PA[0..15]
bus PB[0..15] = sheet U_STM32F7/PB[0..15]
bus PC[0..15] = sheet U_STM32F7/PC[0..15]
bus PD[0..15] = sheet U_STM32F7/PD[0..15]
bus PE[0..15] = sheet U_STM32F7/PE[0..15]
bus PF[0..15] = sheet U_STM32F7/PF[0..15]
bus PG[0..15] = sheet U_STM32F7/PG[0..15]
bus PH[0..15] = sheet U_STM32F7/PH[0..15]
bus PI[0..15] = sheet U_STM32F7/PI[0..15]
bus PJ[0..15] = sheet U_STM32F7/PJ[0..15]
bus PK[0..7] = sheet U_STM32F7/PK[0..7]
bus ULPI_D[0..7] = sheet U_STM32F7/ULPI_D[0..7]
bus ULPI_D[0..7] = sheet U_USB_OTG_HS/ULPI_D[0..7]
harness DSI = sheet U_DSI_LCD/DSI
harness DSI = sheet U_STM32F7/DSI

### Layout directives
rule Matched Net Lengths [Tolerance = 100mil]: (no net found under the mark), FMC_SDCKE0, FMC_SDCLK, FMC_SDNCAS, FMC_SDNE0, FMC_SDNRAS, FMC_SDNWE, PA1, PA2, PA5, PA7, PB2, PB6, PC0, PC1, PC4, PC5, PC9, PC10, PD13, PE2, PG11, PG13, PG14, PH4, PI11
rule Undefined: OSC_25M

### Notes on the sheet
- Title:
- Project:
- Size:
- Revision:
- Variant:
- A4
- -
- Date:
- Reference:
- Sheet:
- of

### Library data of the parts
S1-S4 = Nylon_ScrewM3_Spacer_12.7: Nylon Screw M3 and Spacer 12.7; Manuf_Part_1: Screw M3x6 / Spacer M3x12.7; Manuf_1: JIUBABA; Provided: Sub Co; ECCN_US/EU: n/a

## Sheet AUDIO.SchDoc: Audio Codec WOLFSON and Audio Connectors
size A4; Date: 29-OCT-2015; Author: A.B; CompanyName: STMicroelectronics; Organization: MCD/TOOLS/GNB; Address1: 12, Rue Jules HOROWITZ; Address2: 38019 Grenoble; Address3: FRANCE; DocumentNumber: MB1225; Revision: B-01; SheetNumber: 5; SheetTotal: 13; Project: STM32F769I-DISCO
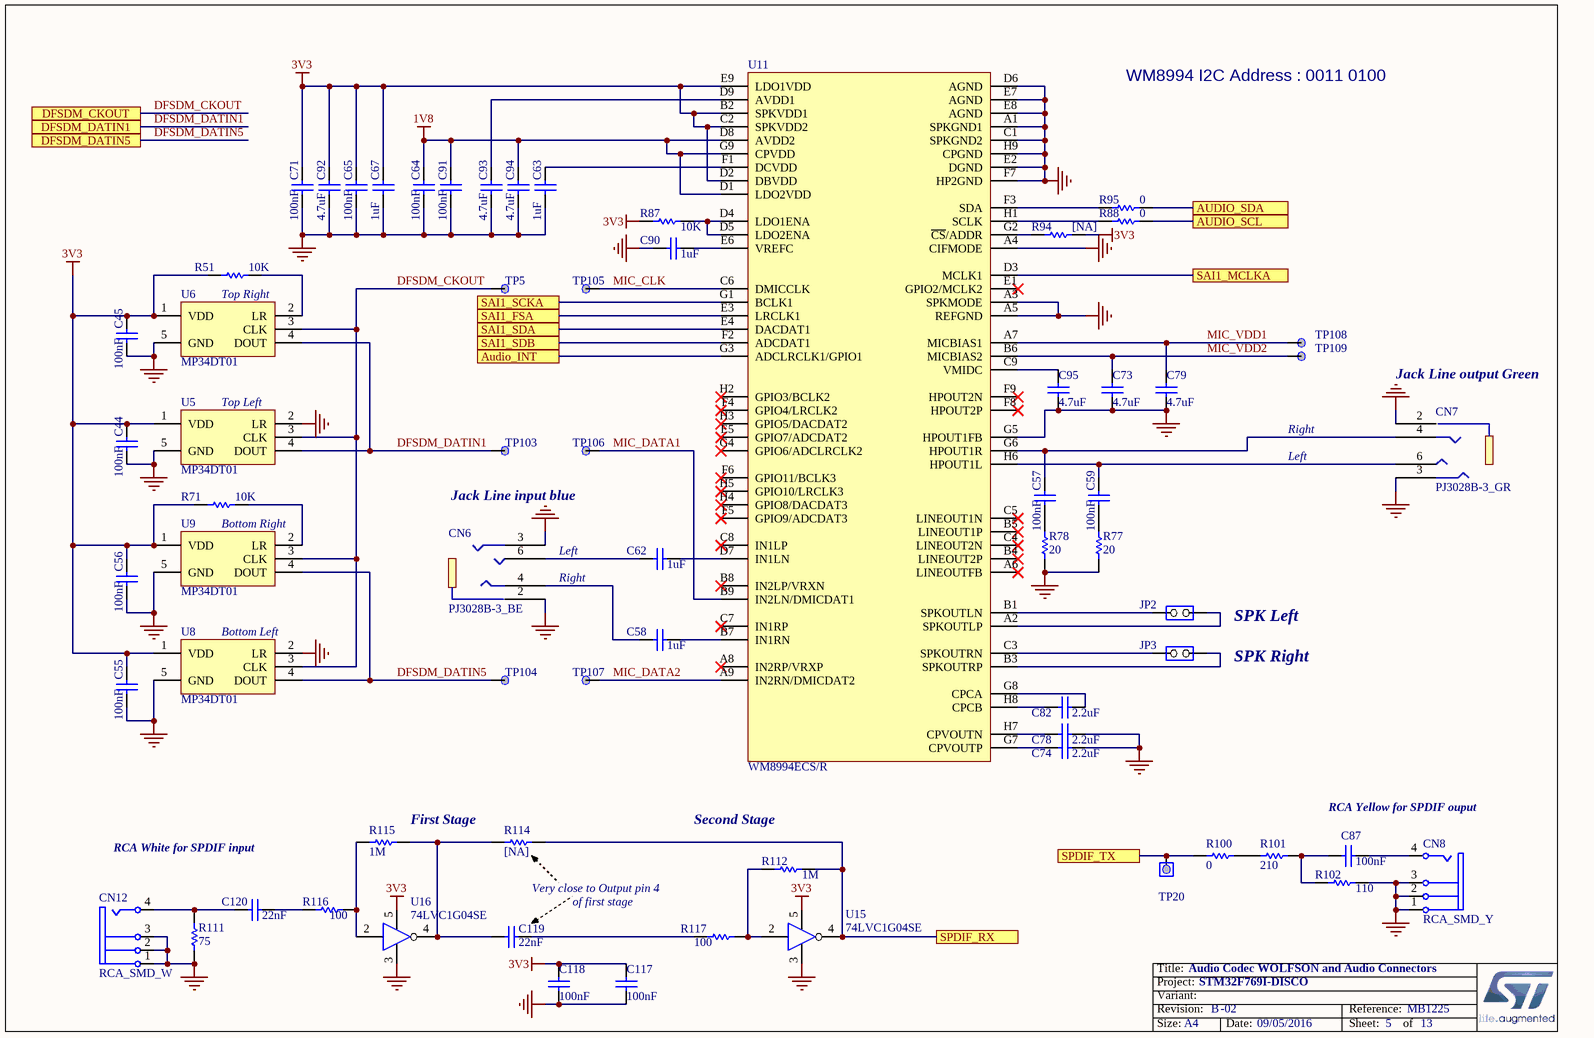
[diagram p2: AUDIO.SchDoc]

### Parts
C44  100nF  [0402C]
C45  100nF  [0402C]
C55  100nF  [0402C]
C56  100nF  [0402C]
C57  100nF  [0402C]
C58  1uF  [0603C]
C59  100nF  [0402C]
C62  1uF  [0603C]
C63  1uF  [0603C]
C64  100nF  [0402C]
C65  100nF  [0402C]
C67  1uF  [0603C]
C71  100nF  [0402C]
C73  4.7uF  [0603C]
C74  2.2uF  [0603C]
C78  2.2uF  [0603C]
C79  4.7uF  [0603C]
C82  2.2uF  [0603C]
C87  100nF  [0402C]
C90  1uF  [0603C]
C91  100nF  [0402C]
C92  4.7uF  [0603C]
C93  4.7uF  [0603C]
C94  4.7uF  [0603C]
C95  4.7uF  [0603C]
C117  100nF  [0402C]
C118  100nF  [0402C]
C119  22nF  [0402C]
C120  22nF  [0402C]
CN6  PJ3028B-3_BE  [PJ3028B]
CN7  PJ3028B-3_GR  [PJ3028B]
CN8  RCA_SMD_Y  [PHONE_JACK_JBB0819100002]
CN12  RCA_SMD_W  [PHONE_JACK_JBB0819100002]
JP2  JP2  [SIP2]  (value not drawn)
JP3  JP2  [SIP2]  (value not drawn)
R51  10K  [0402R]
R71  10K  [0402R]
R77  20  [0402R]
R78  20  [0402R]
R87  10K  [0402R]
R88  0  [0402R]
R94  [NA]  [0402R]
R95  0  [0402R]
R100  0  [0402R]
R101  210  [0402R]
R102  110  [0402R]
R111  75  [0402R]
R112  1M  [0402R]
R114  [NA]  [0402R]
R115  1M  [0402R]
R116  100  [0402R]
R117  100  [0402R]
TP5  TP  [TP_C40]  (value not drawn)
TP20  Test point 1 pin with hole  [TP]  (value not drawn)
TP103  TP  [TP_C40]  (value not drawn)
TP104  TP  [TP_C40]  (value not drawn)
TP105  TP  [TP_C40]  (value not drawn)
TP106  TP  [TP_C40]  (value not drawn)
TP107  TP  [TP_C40]  (value not drawn)
TP108  TP  [TP_C40]  (value not drawn)
TP109  TP  [TP_C40]  (value not drawn)
U5  MP34DT01  [MP34DT01TR]
U6  MP34DT01  [MP34DT01TR]
U8  MP34DT01  [MP34DT01TR]
U9  MP34DT01  [MP34DT01TR]
U11  WM8994ECS/R  [BGA72_0R5_4R5X4]
U15  74LVC1G04SE  [SOT-353]
U16  74LVC1G04SE  [SOT-353]

### Ports
Audio_INT, AUDIO_SCL, AUDIO_SDA, DFSDM_CKOUT, DFSDM_DATIN1, DFSDM_DATIN5, SAI1_FSA, SAI1_MCLKA, SAI1_SCKA, SAI1_SDA, SAI1_SDB, SPDIF_RX, SPDIF_TX

### Nets
1V8: C64.1 C91.1 C94.1 U11.D1(LDO2VDD) U11.D8(AVDD2) U11.G9(CPVDD)
3V3: C44.1 C45.1 C55.1 C56.1 C65.1 C67.2 C71.1 C92.1 C117.2 C118.2 R51.2 R71.2 R87.2 R94.2 U5.1(VDD) U6.1(VDD) U8.1(VDD) U9.1(VDD) U11.B2(SPKVDD1) U11.C2(SPKVDD2) U11.D2(DBVDD) U11.E9(LDO1VDD) U15.5(VCC) U16.5(VCC)
GND: C44.2 C45.2 C55.2 C56.2 C63.1 C64.2 C65.2 C67.1 C71.2 C73.1 C74.2 C78.2 C79.1 C90.2 C91.2 C92.2 C93.2 C94.2 C95.1 C117.1 C118.1 CN6.2 CN6.3 CN7.2 CN7.3 CN8.1(Ground) CN8.2(Ground) CN8.3(Ground) CN12.1(Ground) CN12.2(Ground) CN12.3(Ground) R77.2 R78.2 R102.2 R111.1 U5.2(LR) U5.5(GND) U6.5(GND) U8.2(LR) U8.5(GND) U9.5(GND) U11.A1(SPKGND1) U11.A3(SPKMODE) U11.A4(CIFMODE) U11.A5(REFGND) U11.C1(SPKGND2) U11.D6(AGND) U11.E2(DGND) U11.E7(AGND) U11.E8(AGND) U11.F7(HP2GND) U11.G5(HPOUT1FB) U11.H9(CPGND) U15.3(GND) U16.3(GND)  [project net POE7]
Audio_INT: U11.G3(ADCLRCLK1/GPIO1) ; port Audio_INT
AUDIO_SCL: R88.1 ; port AUDIO_SCL
AUDIO_SDA: R95.1 ; port AUDIO_SDA
DFSDM_CKOUT: TP5.1 U5.3(CLK) U6.3(CLK) U8.3(CLK) U9.3(CLK) ; port DFSDM_CKOUT
DFSDM_DATIN1: TP103.1 U5.4(DOUT) U6.4(DOUT) ; port DFSDM_DATIN1
DFSDM_DATIN5: TP104.1 U8.4(DOUT) U9.4(DOUT) ; port DFSDM_DATIN5
MIC_CLK: TP105.1 U11.C6(DMICCLK)
MIC_DATA1: TP106.1 U11.B9(IN2LN/DMICDAT1)
MIC_DATA2: TP107.1 U11.A9(IN2RN/DMICDAT2)
MIC_VDD1: C79.2 TP108.1 U11.A7(MICBIAS1)
MIC_VDD2: C73.2 TP109.1 U11.B6(MICBIAS2)
PD11: R100.1 TP20.1(COMMON) ; port SPDIF_TX
PE3: U11.F2(ADCDAT1) ; port SAI1_SDB
PE4: U11.E3(LRCLK1) ; port SAI1_FSA
PE5: U11.G1(BCLK1) ; port SAI1_SCKA
PE6: U11.E4(DACDAT1) ; port SAI1_SDA
PG7: U11.D3(MCLK1) ; port SAI1_MCLKA
PG12: R112.2 R114.2 U15.4(Y) ; port SPDIF_RX
NetC57_1: C57.1 CN7.4 U11.G6(HPOUT1R)
NetC57_2: C57.2 R78.1
NetC58_1: C58.1 U11.B7(IN1RN)
NetC58_2: C58.2 CN6.4
NetC59_1: C59.1 CN7.6 U11.H6(HPOUT1L)
NetC59_2: C59.2 R77.1
NetC62_1: C62.1 U11.D7(IN1LN)
NetC62_2: C62.2 CN6.6
NetC63_2: C63.2 U11.F1(DCVDD)
NetC74_1: C74.1 U11.G7(CPVOUTP)
NetC78_1: C78.1 U11.H7(CPVOUTN)
NetC82_1: C82.1 U11.H8(CPCB)
NetC82_2: C82.2 U11.G8(CPCA)
NetC87_1: C87.1 R101.2 R102.1
NetC87_2: C87.2 CN8.4(Signal)
NetC90_1: C90.1 U11.E6(VREFC)
NetC93_1: C93.1 U11.D9(AVDD1)
NetC95_2: C95.2 U11.C9(VMIDC)
NetC119_1: C119.1 R114.1 R115.2 U16.4(Y)
NetC119_2: C119.2 R117.1
NetC120_1: C120.1 CN12.4(Signal) R111.2
NetC120_2: C120.2 R116.1
NetJP2_1: JP2.1(COMMON) U11.B1(SPKOUTLN)
NetJP2_2: JP2.2(NO) U11.A2(SPKOUTLP)
NetJP3_1: JP3.1(COMMON) U11.C3(SPKOUTRN)
NetJP3_2: JP3.2(NO) U11.B3(SPKOUTRP)
NetR51_1: R51.1 U6.2(LR)
NetR71_1: R71.1 U9.2(LR)
NetR87_1: R87.1 U11.D4(LDO1ENA) U11.D5(LDO2ENA)
NetR88_2: R88.2 U11.H1(SCLK)
NetR94_1: R94.1 U11.G2(~{CS}/ADDR)
NetR95_2: R95.2 U11.F3(SDA)
NetR100_2: R100.2 R101.1
NetR112_1: R112.1 R117.2 U15.2(A)
NetR115_1: R115.1 R116.2 U16.2(A)

Not connected (* = marked no-connect by the designer): U11 A6(LINEOUTFB)* A8(IN2RP/VRXP)* B4(LINEOUT2P)* B5(LINEOUT1P)* B8(IN2LP/VRXN)* C4(LINEOUT2N)* C5(LINEOUT1N)* C7(IN1RP)* C8(IN1LP)* E1(GPIO2/MCLK2)* E5(GPIO7/ADCDAT2)* F4(GPIO4/LRCLK2)* F5(GPIO9/ADCDAT3)* F6(GPIO11/BCLK3)* F8(HPOUT2P)* F9(HPOUT2N)* G4(GPIO6/ADCLRCLK2)* H2(GPIO3/BCLK2)* H3(GPIO5/DACDAT2)* H4(GPIO8/DACDAT3)* H5(GPIO10/LRCLK3)*; U15 1(NC); U16 1(NC)

### Notes on the sheet
- WM8994 I2C Address : 0011 0100
- Top Right
- (near CN7) Jack Line output Green
- (near U5) Top Left
- Right
- Jack Line input blue
- Left
- Bottom Right
- (near U8) Bottom Left
- SPK Left
- SPK Right
- RCA White for SPDIF input
- First Stage
- Second Stage
- RCA Yellow for SPDIF ouput
- Very close to Output pin 4
- of first stage
- Title:
- Project:
- Size:
- Revision:
- Variant:
- A4
- -
- Date:
- Reference:
- Sheet:
- of

### Library data of the parts
C44 C45 C55-C57 C59 C64 C65 C71 C87 C91 C117 C118 = Cap_100nF_X7R_10%_0402: Capacitor,100nF,16V,X7R,10%,0402,YAGEO; Manuf_Part_1: CC0402KRX7R7BB104; Revision: July-2002: Re-released for DXP Platform.; Value: 100nF; Order: CC0402KRX7R7BB104; Manuf_1: YAGEO
  C44 C45 C55-C57 C59 C64 C65 C71 C91: ECCN_US/EU: n/a
C58 C62 C63 C67 C90 = Cap_1uF_X5R_10%_0603: Capacitor,1uF,16V,X5R,10%,0603,YAGEO; Manuf_Part_1: CC0603KRX5R7BB105; Revision: July-2002: Re-released for DXP Platform.; Value: 1uF; Order: CC0603KRX5R7BB105; Manuf_1: YAGEO; ECCN_US/EU: n/a
C73 C79 C92-C95 = Cap_4.7uF_X5R_10%_0603: Capacitor,4.7uF,16V, X5R,10%,0603,YAGEO; Manuf_Part_1: CC0603KRX5R7BB475; Order: CC0603KRX5R7BB105; Revision: July-2002: Re-released for DXP Platform.; Value: 4.7uF; Manuf_1: YAGEO; ECCN_US/EU: n/a
C74 C78 C82 = Cap_2.2uF_X5R_10%_0603: Capacitor,2.2uF,10V, X5R,10%,0603,YAGEO; Manuf_Part_1: CC0603KRX5R6BB225; Manuf_Part_2: C0603C225K8PACTU; Manuf_2: KEMET; Revision: July-2002: Re-released for DXP Platform.; Value: 2.2uF; Order: *; Manuf_1: YAGEO; ECCN_US/EU: n/a
C119 C120 = Cap_22nF_X7R_10%_0402: Capacitor,22nF,16V,X7R,10%,0402,YAGEO; Manuf_Part_1: CC0402KRX7R7BB223; Revision: July-2002: Re-released for DXP Platform.; Value: 22nF; Order: CC0402KRX7R7BB223; Manuf_1: YAGEO; ECCN_US/EU: n/a
CN6 = PJ3028B-3_BE: Connector Jack Stereo 3.5mm, female SMT, Blue (Line input); Manuf_Part_2: PJ30280-3_BE; ECCN_US/EU: n/a; Manuf_Part_1: PJ3028B-3_BE; Manuf_1: http://ww.qiaod.com
CN7 = PJ3028B-3_GR: Connector Jack Stereo 3.5mm, female SMT, Green (Line output); Manuf_Part_2: PJ30280-3_GR; ECCN_US/EU: n/a; Manuf_Part_1: PJ3028B-3_GR; Manuf_1: http://ww.qiaod.com
CN8 = RCA_SMD_Y: RCA Phono Jack, Right Angle, SMD, Yellow; Manuf_Part_1: JBB0819100002; Manuf_1: JIUBABA; Manuf_2: CUI Inc; Manuf_Part_2: RCJ-014-SMT; Distrib: Sub Co; ECCN_US/EU: n/a
CN12 = RCA_SMD_W: RCA Phono Jack, Right Angle, SMD, White; Manuf_Part_1: JBB0819100004; Manuf_1: JIUBABA; Manuf_2: CUI Inc; Manuf_Part_2: RCJ-013-SMT; Distrib: Sub Co; ECCN_US/EU: n/a
JP2 JP3 = JP2: Fitted: NO; ECCN_US/EU: n/a
R51 R71 R87 = Res_10K_1%_0402: Resistor,10K,0402,1%,YAGEO; Manuf_Part_1: RC0402FR-0710KL; Value: 10K; Manuf_1: YAGEO; Order: RC0402FR-0710KL; ECCN_US/EU: n/a
R77 R78 = Res_20_1%_0402: Resistor,20,0402,1%,YAGEO; Manuf_Part_1: RC0402FR-0720RL; Value: 20; Manuf_1: YAGEO; Order: *; ECCN_US/EU: n/a
R88 R95 R100 = Res_0_5%_0402: Resistor,0,0402,5%,YAGEO; Manuf_Part_1: RC0402JR-070RL; Order: 2363467; Value: 0; ECCN_US/EU: n/a; Manuf_1: YAGEO; Distrib: FARNELL
R94 R114 = Res_NA_0402: Resistor,[NA],0402; Fitted: NO; Value: [NA]; ECCN_US/EU: n/a
R101 = Res_210_1%_0402: Resistor,210,0402,1%,YAGEO; Manuf_Part_1: RC0402FR-07210RL; Value: 210; Manuf_1: YAGEO; Order: *; ECCN_US/EU: n/a; Distrib: DIGIKEY
R102 = Res_110_1%_0402: Resistor,110,0402,1%,YAGEO; Manuf_Part_1: RC0402FR-07110RL; Value: 110; Manuf_1: YAGEO; Order: *; ECCN_US/EU: n/a; Distrib: Distrib
R111 = Res_75_1%_0402: Resistor,75,0402,1%,YAGEO; Manuf_Part_1: RC0402FR-0775RL; Order: 311-75.0LRTR-ND; Value: 75; Manuf_1: YAGEO; ECCN_US/EU: n/a; Distrib: DIGIKEY
R112 R115 = Res_1M_1%_0402: Resistor,1M,0402,1%,YAGEO; Manuf_Part_1: RC0402FR-071ML; Value: 1M; Manuf_1: YAGEO; Order: RC0402FR-071ML; ECCN_US/EU: n/a
R116 R117 = Res_100_1%_0402: Resistor,100,0402,1%,YAGEO; Manuf_Part_1: RC0402FR-07100RL; Order: 9239111; Value: 100; Manuf_1: YAGEO; ECCN_US/EU: n/a; Distrib: FARNELL
TP5 TP103-TP109 = TP: Test Point; ECCN_US/EU: n/a
TP20 = TP1: Test Point; Fitted: NO; ECCN_US/EU: n/a
U5 U6 U8 U9 = MP34DT01: MEMS audio sensor, omnidirectional digital microphone; Manuf_1: STM; Manuf_Part_1: MP34DT01TR-M; Provided: ST; Ref St: 9188008; ECCN_US/EU: EAR99/NEC; Order: MP34DT01TR-M; Distrib: ST
U11 = WM8994ECS/R: Multi-Channel Audio Hub CODEC for Smartphones; Manuf_1: Cirrus Logic; ECCN_US/EU: EAR99/NEC; Manuf_Part_1: WM8994ECS/R; Distrib: Cirrus Logic
U15 U16 = 74LVC1G04SE: Single inverter gate with a standard push-pull output. (1.65V to 5.5V); Manuf_Part_1: 74LVC1G04SE-7; Manuf_1: DIODES; Order: 1845218; ECCN_US/EU: EAR99/NEC; Footprint: SOT353; Distrib: FARNELL

## Sheet QSPI.SchDoc: Quad SPI Flash Memory (MICRON)
size A4; Date: 29-OCT-2015; Author: A.B; CompanyName: STMicroelectronics; Organization: MCD/TOOLS/GNB; Address1: 12, Rue Jules HOROWITZ; Address2: 38019 Grenoble; Address3: FRANCE; DocumentNumber: MB1225; Revision: B-01; SheetNumber: 7; SheetTotal: 13; Project: STM32F769I-DISCO
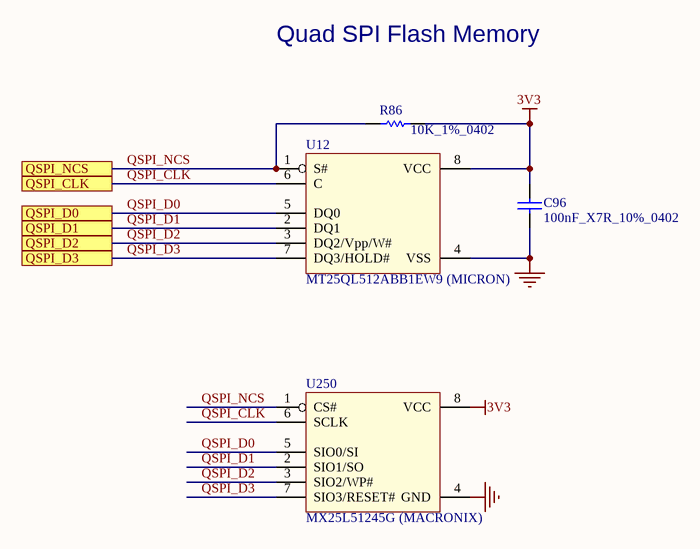
[diagram p3: QSPI.SchDoc]

### Parts
C96  100nF_X7R_10%_0402  [0402C]
R86  10K_1%_0402  [0402R]
U12  MT25QL512ABB1EW9 (MICRON)  [DFN8_1R27_6X8_TP4R8X5R16]
U250  MX25L51245G (MACRONIX)  [SON8_1R27_6X8]

### Ports
QSPI_CLK, QSPI_D0, QSPI_D1, QSPI_D2, QSPI_D3, QSPI_NCS

### Nets
3V3: C96.2 R86.2 U12.8(VCC) U250.8(VCC)
GND: C96.1 U12.4(VSS) U250.4(GND)  [project net POE7]
QSPI_CLK: U12.6(C) U250.6(SCLK) ; port QSPI_CLK  [project net PB2]
QSPI_D0: U12.5(DQ0) U250.5(SIO0/SI) ; port QSPI_D0  [project net PC9]
QSPI_D1: U12.2(DQ1) U250.2(SIO1/SO) ; port QSPI_D1  [project net PC10]
QSPI_D2: U12.3(DQ2/Vpp/W#) U250.3(SIO2/WP#) ; port QSPI_D2  [project net PE2]
QSPI_D3: U12.7(DQ3/HOLD#) U250.7(SIO3/RESET#) ; port QSPI_D3  [project net PD13]
QSPI_NCS: R86.1 U12.1(S#) U250.1(CS#) ; port QSPI_NCS  [project net PB6]

### Notes on the sheet
- Quad SPI Flash Memory
- Title:
- Project:
- Size:
- Revision:
- Variant:
- A4
- -
- Date:
- Reference:
- Sheet:
- of

### Library data of the parts
C96 = Cap_100nF_X7R_10%_0402: as C44 on sheet AUDIO; Revision: July-2002: Re-released for DXP Platform.; Value: 100nF; Order: CC0402KRX7R7BB104; Manuf_1: YAGEO; ECCN_US/EU: n/a
R86 = Res_10K_1%_0402: as R51 on sheet AUDIO; Value: 10K; Manuf_1: YAGEO; Order: RC0402FR-0710KL; ECCN_US/EU: n/a
U12 = MT25QL512ABB1EW9: 512Mb, 3V, Multiple I/O Serial Flash Memory, Quad/Dual; Manuf_Part_2: N25Q512A13GF840E; Manuf_Part_1: MT25QL512ABB1EW9-0SIT; ECCN_US/EU: 3A991/NEC; Provided: ST; Ref St: xxxxxxxx; Note: MX25L51245GZ2I-08G can also be use but with a different footprint; Fitted: NO; Manuf_1: MICRON; Distrib: MICRON
U250 = MX25L51245G: 512Mb, 3V, Multiple I/O Serial Flash Memory, Quad/Dual; Manuf_Part_1: MX25L51245GZ2I-08G; Manuf_Part_2: MX25L51245GZ2I-10G; ECCN_US/EU: 3A991/NEC; Provided: Sub Co; Ref St: xxxxxxxxxx; Note: MT25QL512ABB1EW9 can be also used but with a different footprint; Manuf_1: MACRONIX; Distrib: MACRONIX

## Sheet SDRAM.SchDoc: SDRAM (MICRON)
size A4; Date: 29-OCT-2015; Author: A.B; CompanyName: STMicroelectronics; Organization: MCD/TOOLS/GNB; Address1: 12, Rue Jules HOROWITZ; Address2: 38019 Grenoble; Address3: FRANCE; DocumentNumber: MB1225; Revision: B-01; SheetNumber: 6; SheetTotal: 13; Project: STM32F769I-DISCO
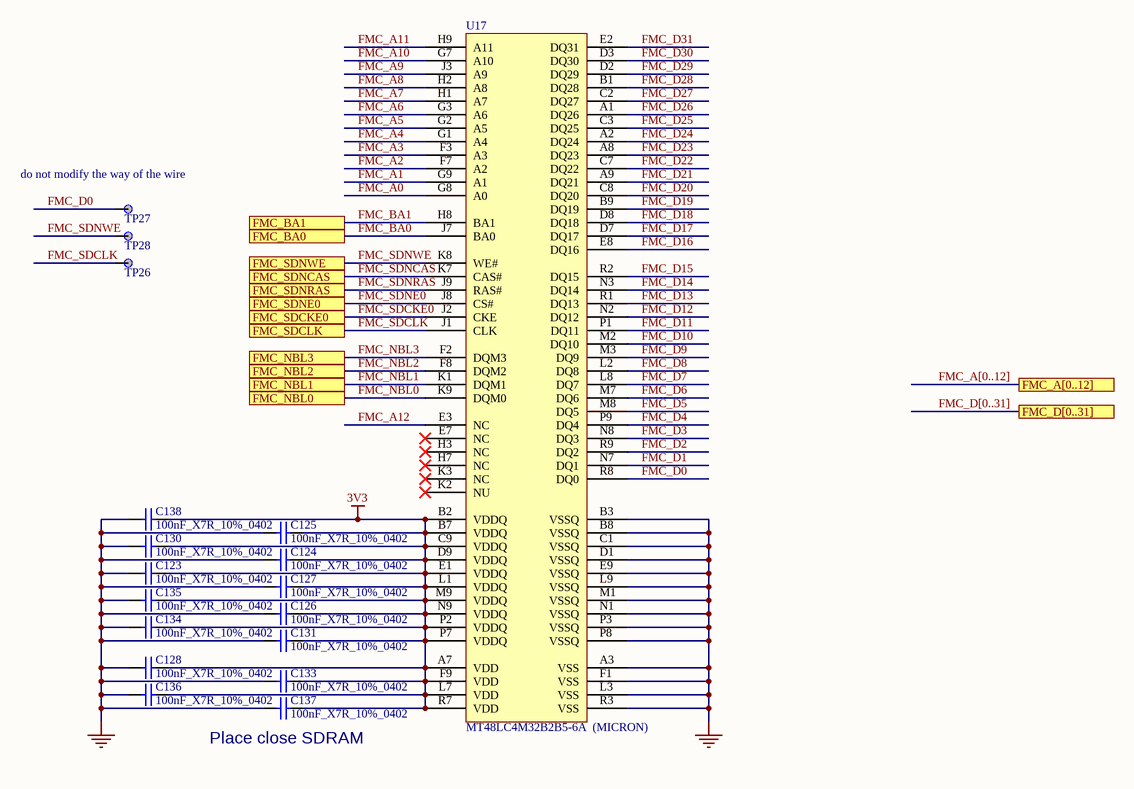
[diagram p4: SDRAM.SchDoc]

### Parts
C123  100nF_X7R_10%_0402  [0402C]
C124  100nF_X7R_10%_0402  [0402C]
C125  100nF_X7R_10%_0402  [0402C]
C126  100nF_X7R_10%_0402  [0402C]
C127  100nF_X7R_10%_0402  [0402C]
C128  100nF_X7R_10%_0402  [0402C]
C130  100nF_X7R_10%_0402  [0402C]
C131  100nF_X7R_10%_0402  [0402C]
C133  100nF_X7R_10%_0402  [0402C]
C134  100nF_X7R_10%_0402  [0402C]
C135  100nF_X7R_10%_0402  [0402C]
C136  100nF_X7R_10%_0402  [0402C]
C137  100nF_X7R_10%_0402  [0402C]
C138  100nF_X7R_10%_0402  [0402C]
TP26  TP  [TP_C40]  (value not drawn)
TP27  TP  [TP_C40]  (value not drawn)
TP28  TP  [TP_C40]  (value not drawn)
U17  MT48LC4M32B2B5-6A  (MICRON)  [FBGA90_0R8_8X13]

### Ports
FMC_A[0..12], FMC_BA0, FMC_BA1, FMC_D[0..31], FMC_NBL0, FMC_NBL1, FMC_NBL2, FMC_NBL3, FMC_SDCKE0, FMC_SDCLK, FMC_SDNCAS, FMC_SDNE0, FMC_SDNRAS, FMC_SDNWE

### Nets
3V3: C123.2 C124.2 C125.2 C126.2 C127.2 C128.2 C130.2 C131.2 C133.2 C134.2 C135.2 C136.2 C137.2 C138.2 U17.A7(VDD) U17.B2(VDDQ) U17.B7(VDDQ) U17.C9(VDDQ) U17.D9(VDDQ) U17.E1(VDDQ) U17.F9(VDD) U17.L1(VDDQ) U17.L7(VDD) U17.M9(VDDQ) U17.N9(VDDQ) U17.P2(VDDQ) U17.P7(VDDQ) U17.R7(VDD)
GND: C123.1 C124.1 C125.1 C126.1 C127.1 C128.1 C130.1 C131.1 C133.1 C134.1 C135.1 C136.1 C137.1 C138.1 U17.A3(VSS) U17.B3(VSSQ) U17.B8(VSSQ) U17.C1(VSSQ) U17.D1(VSSQ) U17.E9(VSSQ) U17.F1(VSS) U17.L3(VSS) U17.L9(VSSQ) U17.M1(VSSQ) U17.N1(VSSQ) U17.P3(VSSQ) U17.P8(VSSQ) U17.R3(VSS)  [project net POE7]
FMC_A0: U17.G8(A0)
FMC_A1: U17.G9(A1)
FMC_A2: U17.F7(A2)
FMC_A3: U17.F3(A3)
FMC_A4: U17.G1(A4)
FMC_A5: U17.G2(A5)
FMC_A6: U17.G3(A6)
FMC_A7: U17.H1(A7)
FMC_A8: U17.H2(A8)
FMC_A9: U17.J3(A9)
FMC_A10: U17.G7(A10)
FMC_A11: U17.H9(A11)
FMC_A12: U17.E3(NC)
FMC_BA0: U17.J7(BA0) ; port FMC_BA0
FMC_BA1: U17.H8(BA1) ; port FMC_BA1
FMC_D0: TP27.1 U17.R8(DQ0)
FMC_D1: U17.N7(DQ1)
FMC_D2: U17.R9(DQ2)
FMC_D3: U17.N8(DQ3)
FMC_D4: U17.P9(DQ4)
FMC_D5: U17.M8(DQ5)
FMC_D6: U17.M7(DQ6)
FMC_D7: U17.L8(DQ7)
FMC_D8: U17.L2(DQ8)
FMC_D9: U17.M3(DQ9)
FMC_D10: U17.M2(DQ10)
FMC_D11: U17.P1(DQ11)
FMC_D12: U17.N2(DQ12)
FMC_D13: U17.R1(DQ13)
FMC_D14: U17.N3(DQ14)
FMC_D15: U17.R2(DQ15)
FMC_D16: U17.E8(DQ16)
FMC_D17: U17.D7(DQ17)
FMC_D18: U17.D8(DQ18)
FMC_D19: U17.B9(DQ19)
FMC_D20: U17.C8(DQ20)
FMC_D21: U17.A9(DQ21)
FMC_D22: U17.C7(DQ22)
FMC_D23: U17.A8(DQ23)
FMC_D24: U17.A2(DQ24)
FMC_D25: U17.C3(DQ25)
FMC_D26: U17.A1(DQ26)
FMC_D27: U17.C2(DQ27)
FMC_D28: U17.B1(DQ28)
FMC_D29: U17.D2(DQ29)
FMC_D30: U17.D3(DQ30)
FMC_D31: U17.E2(DQ31)
FMC_NBL0: U17.K9(DQM0) ; port FMC_NBL0
FMC_NBL1: U17.K1(DQM1) ; port FMC_NBL1
FMC_NBL2: U17.F8(DQM2) ; port FMC_NBL2
FMC_NBL3: U17.F2(DQM3) ; port FMC_NBL3
FMC_SDCKE0: U17.J2(CKE) ; port FMC_SDCKE0
FMC_SDCLK: TP26.1 U17.J1(CLK) ; port FMC_SDCLK
FMC_SDNCAS: U17.K7(CAS#) ; port FMC_SDNCAS
FMC_SDNE0: U17.J8(CS#) ; port FMC_SDNE0
FMC_SDNRAS: U17.J9(RAS#) ; port FMC_SDNRAS
FMC_SDNWE: TP28.1 U17.K8(WE#) ; port FMC_SDNWE

Not connected (* = marked no-connect by the designer): U17 E7(NC)* H3(NC)* H7(NC)* K2(NU)* K3(NC)*

### Buses and harness runs
bus FMC_A[0..12] = port FMC_A[0..12]
bus FMC_D[0..31] = port FMC_D[0..31]

### Notes on the sheet
- (near TP27) do not modify the way of the wire
- (near C137) Place close SDRAM
- Title:
- Project:
- Size:
- Revision:
- Variant:
- A4
- -
- Date:
- Reference:
- Sheet:
- of

### Library data of the parts
C123-C128 C130 C131 C133-C138 = Cap_100nF_X7R_10%_0402: as C44 on sheet AUDIO; Revision: July-2002: Re-released for DXP Platform.; Value: 100nF; Order: CC0402KRX7R7BB104; Manuf_1: YAGEO; ECCN_US/EU: n/a
TP26-TP28 = TP: Test Point; ECCN_US/EU: n/a
U17 = MT48LC4M32B2B5-6A: SDRAM 128MBIT (4M x 32) 166MHZ 90-VFBGA (8x13); Manuf_Part_1: MT48LC4M32B2B5-6A IT:L TR; Order: MT48LC4M32B2B5-6A IT:L TR-ND; ECCN_US/EU: EAR99/NEC; Provided: ST; Ref St: 9171434; Manuf_1: MICRON; Distrib: MICRON